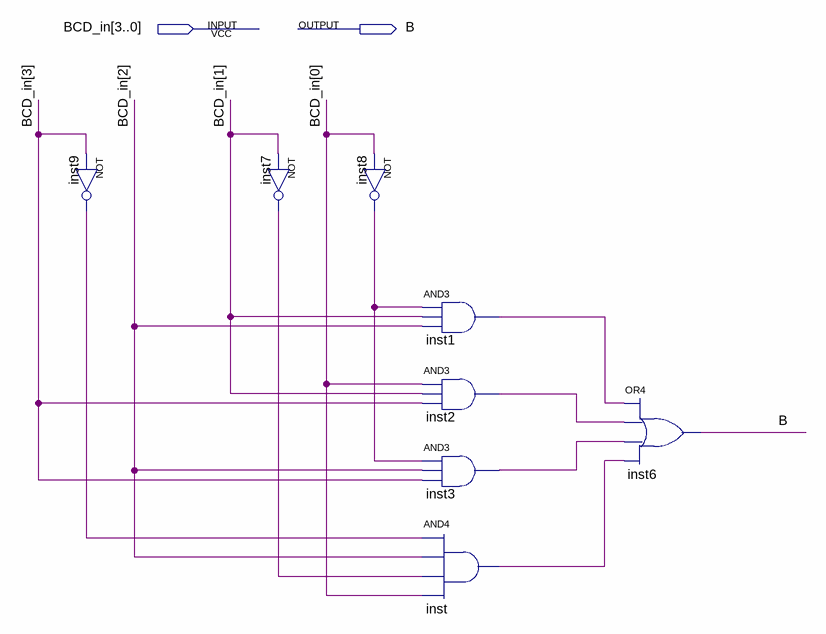
[diagram p0: schematic sheet]
// Quartus schematic B.bdf as structural Verilog: 8 symbols, 2 pins
module B (
  input  [3:0] BCD_in,
  output B
);

  wire inst1_out, inst2_out, inst3_out, inst7_out, inst8_out, inst9_out, inst_out;

  not inst9 (inst9_out, BCD_in[3]);
  not inst7 (inst7_out, BCD_in[1]);
  not inst8 (inst8_out, BCD_in[0]);
  and inst1 (inst1_out, inst8_out, BCD_in[1], BCD_in[2]);
  and inst2 (inst2_out, BCD_in[0], BCD_in[1], BCD_in[3]);
  and inst3 (inst3_out, inst8_out, BCD_in[2], BCD_in[3]);
  and inst (inst_out, inst9_out, BCD_in[2], inst7_out, BCD_in[0]);
  or inst6 (B, inst1_out, inst2_out, inst3_out, inst_out);
endmodule
